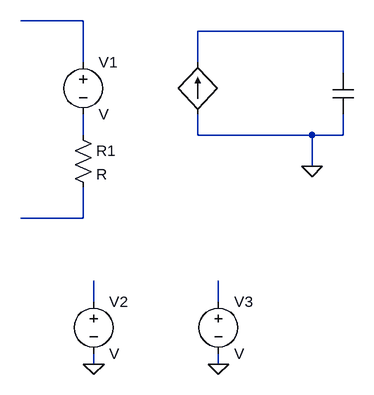
[diagram p0: schematic HP_SPICE.asc]
HP_SPICE.asc, the LTspice schematic file:
Version 4
SHEET 1 880 680
WIRE 128 48 32 48
WIRE 528 64 304 64
WIRE 128 112 128 48
WIRE 304 112 304 64
WIRE 528 128 528 64
WIRE 128 224 128 192
WIRE 304 224 304 192
WIRE 480 224 304 224
WIRE 528 224 528 192
WIRE 528 224 480 224
WIRE 480 272 480 224
WIRE 128 352 128 304
WIRE 128 352 32 352
WIRE 144 480 144 448
WIRE 336 480 336 448
WIRE 144 576 144 560
WIRE 336 576 336 560
FLAG 480 272 0
FLAG 144 576 0
FLAG 336 576 0
SYMBOL voltage 144 464 R0
SYMATTR InstName V2
SYMBOL voltage 336 464 R0
SYMATTR InstName V3
SYMBOL bi2 304 112 R0
WINDOW 0 24 0 Invisible 2
WINDOW 3 24 81 Invisible 2
SYMATTR InstName B1
SYMATTR Value I=
SYMBOL cap 512 128 R0
WINDOW 0 24 8 Invisible 2
WINDOW 3 24 56 Invisible 2
SYMATTR InstName C1
SYMBOL res 112 208 R0
SYMATTR InstName R1
SYMBOL voltage 128 96 R0
SYMATTR InstName V1

The netlist it stands for:
* HP_SPICE.asc
V2 N005 0 V
V3 N006 0 V
B1 0 N002 I=
C1 N002 0 C
R1 N003 N004 R
V1 N001 N003 V
.backanno
.end